# Altium schematic sheet RPL_POWER_SOLENOIDS_REV2.SchDoc: Solenoid Driver
size A; Date: Dec 27, 2017; DrawnBy: Seyed Omid Hasanli; Revision: 2.0; SheetNumber: 9
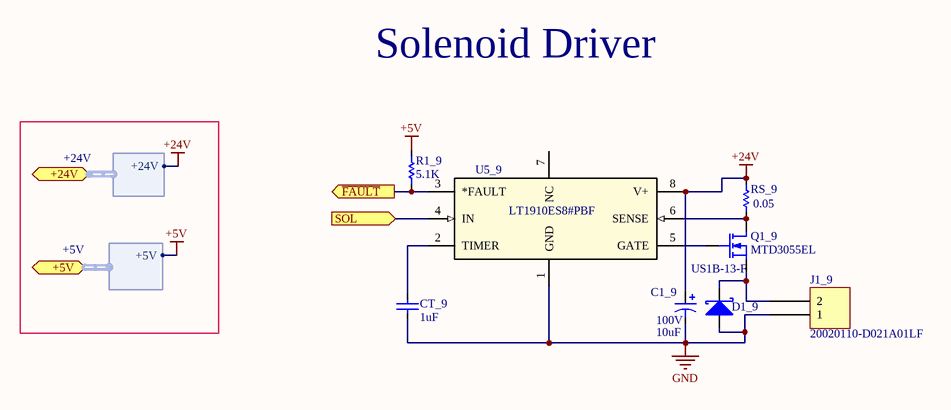
[diagram p0: RPL_POWER_SOLENOIDS_REV2.SchDoc]

## Parts
C1_9  100V  value 10uF  [(1210) CAPC3225X280]
CT_9  value 1uF  [(1210) CAPC3225X280]  (hidden comment: Cap)
D1_9  US1B-13-F  [US1B-13-F]
J1_9  20020110-D021A01LF  [FCI 06-381-2PIN]
Q1_9  MTD3055EL  [TO229P990X239-3N]
R1_9  value 5.1K  [RES 0805]  (hidden comment: Res)
RS_9  value 0.05  [RES 1206]  (hidden comment: Res)
U5_9  LT1910ES8#PBF  [SO-8_S]

## Ports
+5V (harness +5V), +24V (harness +24V), SOL (in), ~{FAULT} (out)

## Harnesses
+24V: +24V
+5V: +5V

## Nets
+5V: R1_9.2 ; port +5V.+5V
+24V: C1_9.1 RS_9.2 U5_9.8(V+) ; port +24V.+24V
GND: C1_9.2 CT_9.1 D1_9.1(A) J1_9.1 U5_9.1(GND)
~{FAULT}: R1_9.1 U5_9.3(*FAULT) ; port ~{FAULT}
SOL: U5_9.4(IN) ; port SOL
NetCT_9_2: CT_9.2 U5_9.2(TIMER)
NetD1_9_2: D1_9.2(K) J1_9.2 Q1_9.3(S)
NetQ1_9_1: Q1_9.1(D) RS_9.1 U5_9.6(SENSE)
NetQ1_9_2: Q1_9.2(G) U5_9.5(GATE)

Not connected (* = marked no-connect by the designer): U5_9 7(NC)

## Notes on the sheet
- Solenoid Driver
- Title:
- DrawnBy:
- Revision:
- SheetNumber:
- Date:
- Datasheet Link:

## Library data of the parts
C1_9 = Cap Elec
D1_9 = Diod
J1_9 = 20020110-D021A01LF: TERM BLOCK HDR 2POS R/A 3.81MM; Manufacturer: FCI; TemperatureRange: -40C ~ 115C; Voltage: 300V; Pitch: 0.150" (3.81mm); Number Of Positions: 2; Number Of Levels: 1; Part Number: 20020110-D021A01LF; PartId: 7785; Supplier 1: Digi-Key; Supplier Part Number 1: 609-3819-ND; ComponentLink1Description: Datasheet; ComponentLink1URL: http://portal.fciconnect.com/Comergent//fci/drawing/20020110.pdf; ComponentLink2Description: Digi-Key Listing; ComponentLink2URL: http://www.digikey.ca/product-detail/en/20020110-D021A01LF/609-3819-ND/2261255; Price: 0.75; Type: Through Hole; Colour: Green; Orientation: 90, Right Angle; Positions Per Level: 2
Q1_9 = Mosfet
U5_9 = LT1910ES8#PBF: Imported; Vendor: Linear Technology; Manufacturer_Part_Number: lt1910es8#pbf; Value: Value; Type: Type; RefDes: RefDes